# EAGLE design mindbrain_schematic_v2 (EAGLE 7.2.0)
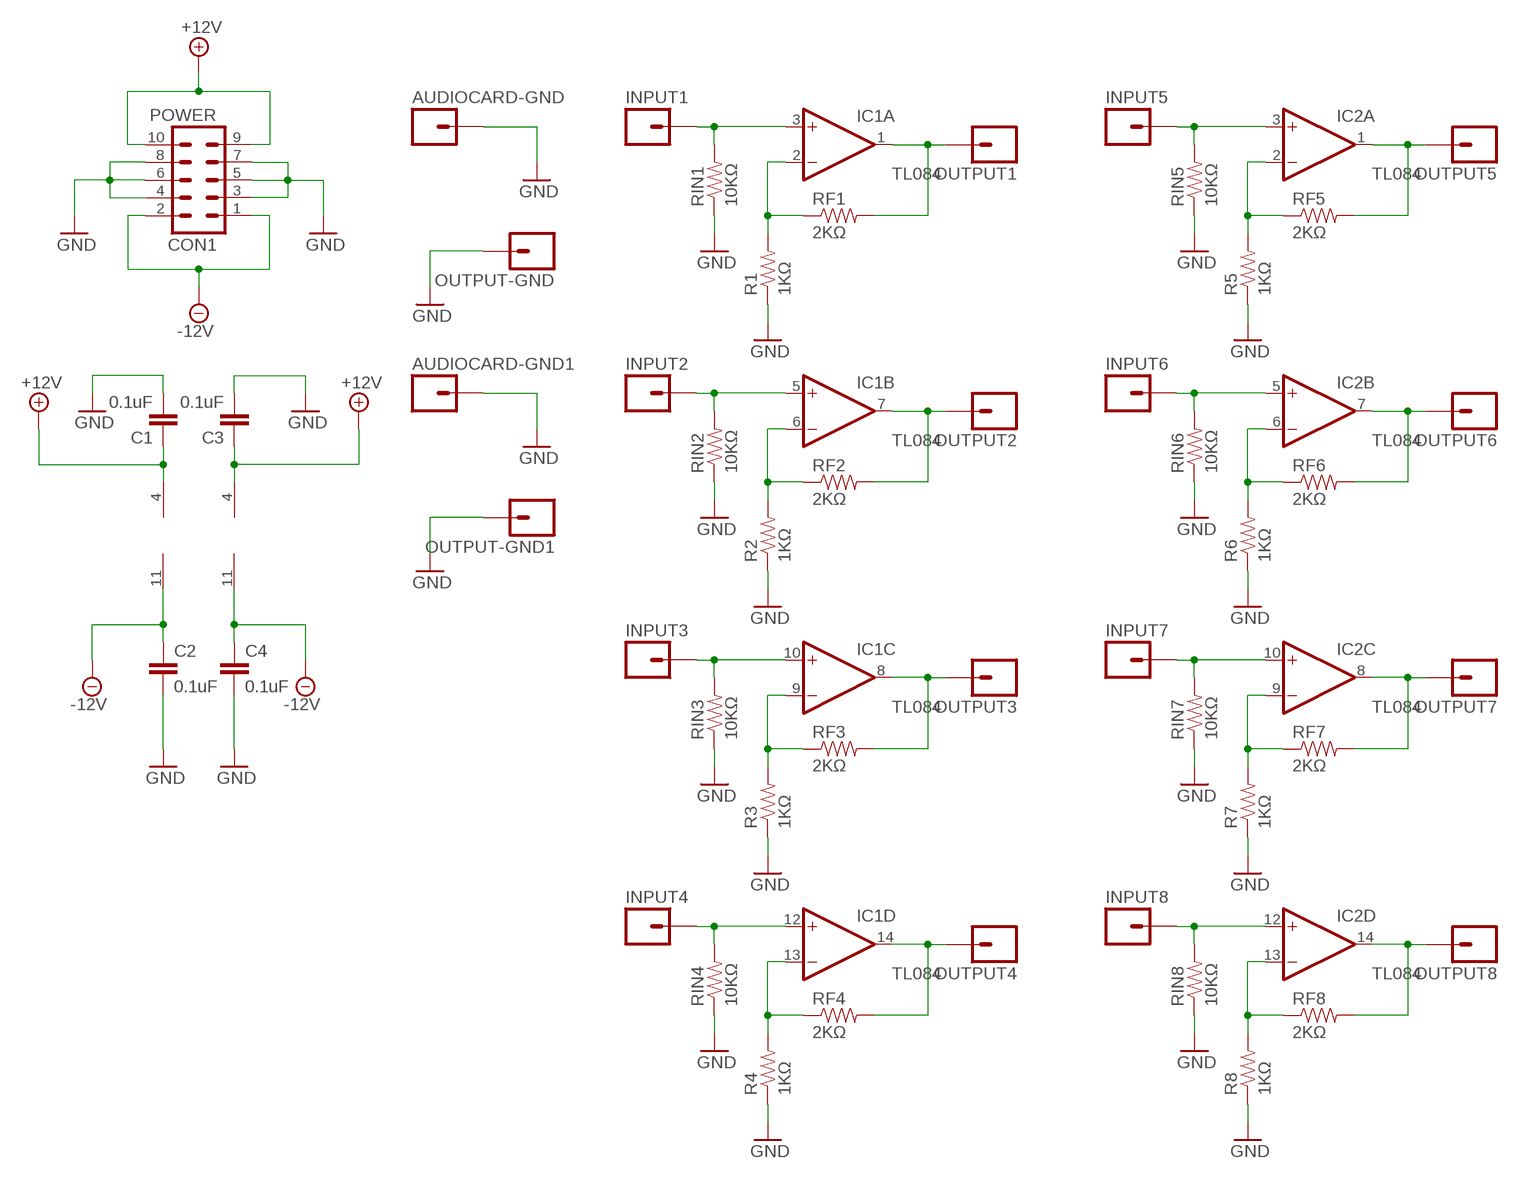
[diagram p0: schematic, sheet 1]

## Parts
AUDIOCARD-GND  M01NOSILK-KIT  [1X01NS-KIT]
AUDIOCARD-GND1  M01NOSILK-KIT  [1X01NS-KIT]
C1  0.1uF  CAPKIT  [CAP-PTH-SMALL-KIT]
C2  0.1uF  CAPKIT  [CAP-PTH-SMALL-KIT]
C3  0.1uF  CAPKIT  [CAP-PTH-SMALL-KIT]
C4  0.1uF  CAPKIT  [CAP-PTH-SMALL-KIT]
CON1  POWER  M05X2SHD  [2X5-SHROUDED]
IC1  TL084  TL084P  [DIL14]
IC2  TL084  TL084P  [DIL14]
INPUT1  M01NOSILK-KIT  [1X01NS-KIT]
INPUT2  M01NOSILK-KIT  [1X01NS-KIT]
INPUT3  M01NOSILK-KIT  [1X01NS-KIT]
INPUT4  M01NOSILK-KIT  [1X01NS-KIT]
INPUT5  M01NOSILK-KIT  [1X01NS-KIT]
INPUT6  M01NOSILK-KIT  [1X01NS-KIT]
INPUT7  M01NOSILK-KIT  [1X01NS-KIT]
INPUT8  M01NOSILK-KIT  [1X01NS-KIT]
OUTPUT1  M01NOSILK-KIT  [1X01NS-KIT]
OUTPUT2  M01NOSILK-KIT  [1X01NS-KIT]
OUTPUT3  M01NOSILK-KIT  [1X01NS-KIT]
OUTPUT4  M01NOSILK-KIT  [1X01NS-KIT]
OUTPUT5  M01NOSILK-KIT  [1X01NS-KIT]
OUTPUT6  M01NOSILK-KIT  [1X01NS-KIT]
OUTPUT7  M01NOSILK-KIT  [1X01NS-KIT]
OUTPUT8  M01NOSILK-KIT  [1X01NS-KIT]
OUTPUT-GND  M01NOSILK-KIT  [1X01NS-KIT]
OUTPUT-GND1  M01NOSILK-KIT  [1X01NS-KIT]
R1  1KΩ  RESISTORPTH-1/4W  [AXIAL-0.4]
R2  1KΩ  RESISTORPTH-1/4W  [AXIAL-0.4]
R3  1KΩ  RESISTORPTH-1/4W  [AXIAL-0.4]
R4  1KΩ  RESISTORPTH-1/4W  [AXIAL-0.4]
R5  1KΩ  RESISTORPTH-1/4W  [AXIAL-0.4]
R6  1KΩ  RESISTORPTH-1/4W  [AXIAL-0.4]
R7  1KΩ  RESISTORPTH-1/4W  [AXIAL-0.4]
R8  1KΩ  RESISTORPTH-1/4W  [AXIAL-0.4]
RF1  2KΩ  RESISTORPTH-1/4W  [AXIAL-0.4]
RF2  2KΩ  RESISTORPTH-1/4W  [AXIAL-0.4]
RF3  2KΩ  RESISTORPTH-1/4W  [AXIAL-0.4]
RF4  2KΩ  RESISTORPTH-1/4W  [AXIAL-0.4]
RF5  2KΩ  RESISTORPTH-1/4W  [AXIAL-0.4]
RF6  2KΩ  RESISTORPTH-1/4W  [AXIAL-0.4]
RF7  2KΩ  RESISTORPTH-1/4W  [AXIAL-0.4]
RF8  2KΩ  RESISTORPTH-1/4W  [AXIAL-0.4]
RIN1  10KΩ  RESISTORPTH-1/4W  [AXIAL-0.4]
RIN2  10KΩ  RESISTORPTH-1/4W  [AXIAL-0.4]
RIN3  10KΩ  RESISTORPTH-1/4W  [AXIAL-0.4]
RIN4  10KΩ  RESISTORPTH-1/4W  [AXIAL-0.4]
RIN5  10KΩ  RESISTORPTH-1/4W  [AXIAL-0.4]
RIN6  10KΩ  RESISTORPTH-1/4W  [AXIAL-0.4]
RIN7  10KΩ  RESISTORPTH-1/4W  [AXIAL-0.4]
RIN8  10KΩ  RESISTORPTH-1/4W  [AXIAL-0.4]

## Nets
+12V: C1.1 C3.1 CON1.9 CON1.10 IC1.4(P:V+) IC2.4(P:V+)
-12V: C2.1 C4.1 CON1.1 CON1.2 IC1.11(P:V-) IC2.11(P:V-)
GND: AUDIOCARD-GND1.1 AUDIOCARD-GND.1 C1.2 C2.2 C3.2 C4.2 CON1.3 CON1.4 CON1.5 CON1.6 CON1.7 CON1.8 OUTPUT-GND1.1 OUTPUT-GND.1 R1.P$1 R2.P$1 R3.P$1 R4.P$1 R5.P$1 R6.P$1 R7.P$1 R8.P$1 RIN1.P$1 RIN2.P$1 RIN3.P$1 RIN4.P$1 RIN5.P$1 RIN6.P$1 RIN7.P$1 RIN8.P$1
N$1: IC1.3(A:+IN) INPUT1.1 RIN1.P$2
N$2: IC1.1(A:OUT) OUTPUT1.1 RF1.P$2
N$3: IC1.2(A:-IN) R1.P$2 RF1.P$1
N$4: IC1.5(B:+IN) INPUT2.1 RIN2.P$2
N$5: IC1.7(B:OUT) OUTPUT2.1 RF2.P$2
N$6: IC1.6(B:-IN) R2.P$2 RF2.P$1
N$7: IC1.10(C:+IN) INPUT3.1 RIN3.P$2
N$8: IC1.8(C:OUT) OUTPUT3.1 RF3.P$2
N$9: IC1.9(C:-IN) R3.P$2 RF3.P$1
N$10: IC1.12(D:+IN) INPUT4.1 RIN4.P$2
N$11: IC1.14(D:OUT) OUTPUT4.1 RF4.P$2
N$12: IC1.13(D:-IN) R4.P$2 RF4.P$1
N$13: IC2.3(A:+IN) INPUT5.1 RIN5.P$2
N$14: IC2.1(A:OUT) OUTPUT5.1 RF5.P$2
N$15: IC2.2(A:-IN) R5.P$2 RF5.P$1
N$16: IC2.5(B:+IN) INPUT6.1 RIN6.P$2
N$17: IC2.7(B:OUT) OUTPUT6.1 RF6.P$2
N$18: IC2.6(B:-IN) R6.P$2 RF6.P$1
N$19: IC2.10(C:+IN) INPUT7.1 RIN7.P$2
N$20: IC2.8(C:OUT) OUTPUT7.1 RF7.P$2
N$21: IC2.9(C:-IN) R7.P$2 RF7.P$1
N$22: IC2.12(D:+IN) INPUT8.1 RIN8.P$2
N$23: IC2.14(D:OUT) OUTPUT8.1 RF8.P$2
N$24: IC2.13(D:-IN) R8.P$2 RF8.P$1

## Library data of the parts
AUDIOCARD-GND AUDIOCARD-GND1 INPUT1-INPUT8 OUTPUT1-OUTPUT8 OUTPUT-GND OUTPUT-GND1 = SparkFun-Connectors:M01: Header 1 Standard 1-pin 0.1" header. Use with straight break away headers (SKU : PRT-00116), right angle break away headers (PRT-00553), swiss pins (PRT-00743), machine pins (PRT-00117), and female headers (PRT-00115).
C1-C4 = SparkFun-Capacitors:CAP: Capacitor Standard 0603 ceramic capacitor, and 0.1" leaded capacitor.
CON1 = SparkFun-Connectors:M05X2: Header 5x2 Standard 10-pin dual row 0.1" header. Commonly used with AVR-ISP. Use with Spark Fun Electronics SKU: PRT-00778
IC1 IC2 = linear:TL084: OP AMP
R1-R8 RF1-RF8 RIN1-RIN8 = SparkFun-Passives:RESISTOR: Resistor Basic schematic elements and footprints for 0603, 1206, and PTH resistors.

## Board
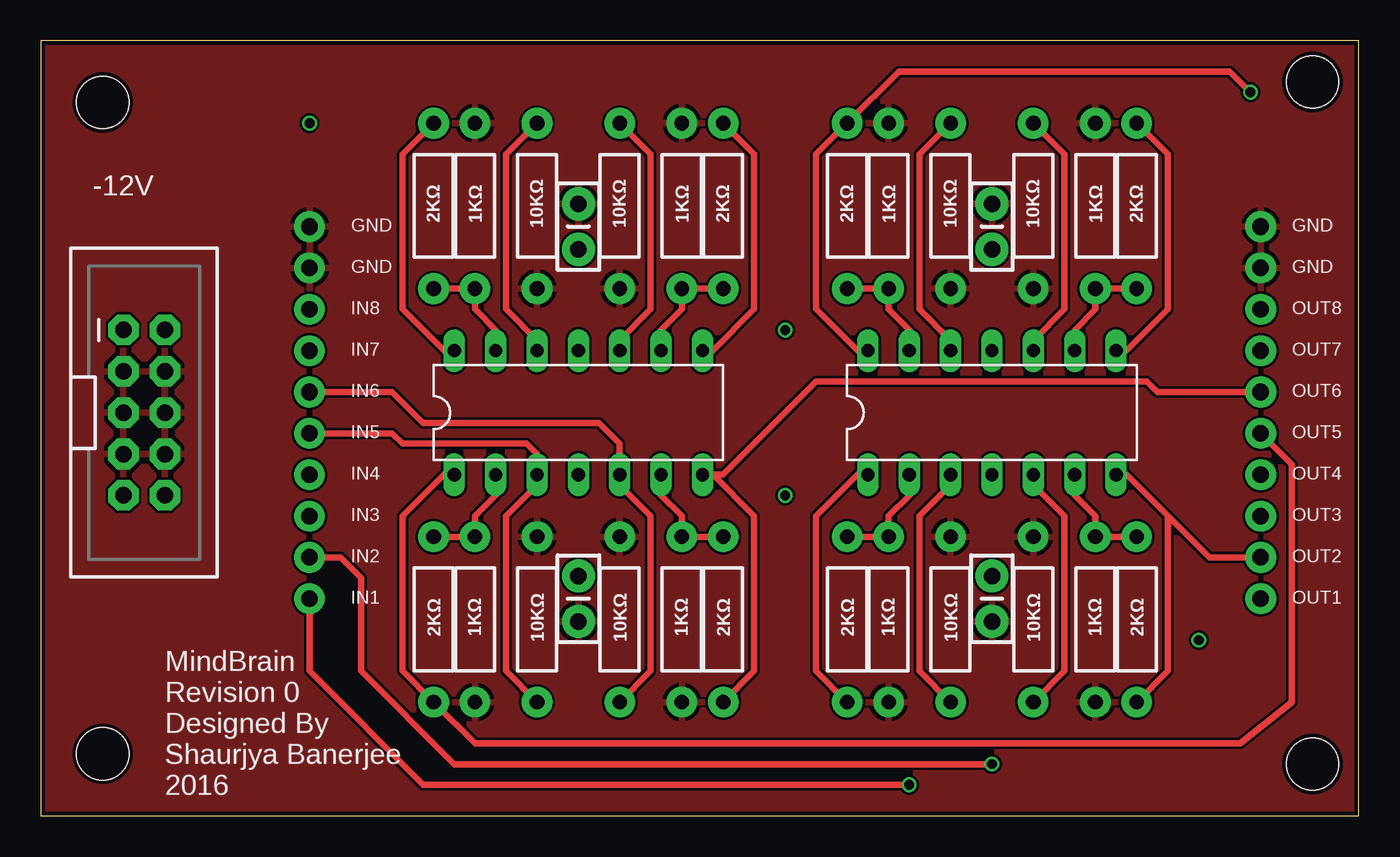
[diagram p1: board, top side]
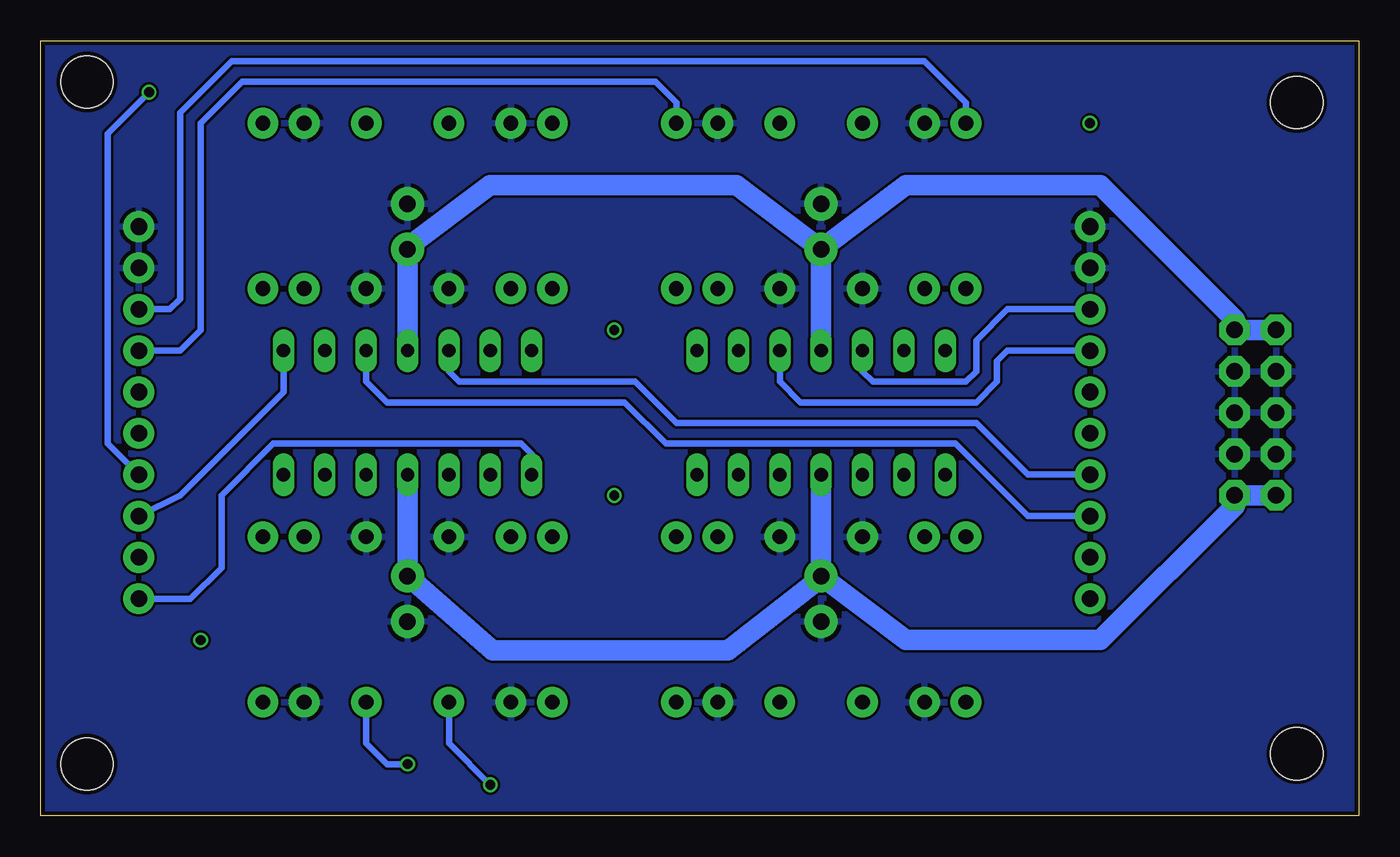
[diagram p2: board, bottom side, seen from below]

Size 80.95 x 47.62 mm. Coordinates in mm from the lower left corner, seen from the top.
Outline: 0,0 80.95,0 80.95,47.62 0,47.62 0,0
Copper layers (1*16): Top 0.035mm / dielectric 1.5mm / Bottom 0.035mm
Design rules "SeeedStudio_2layer_DRU_no_angle_20140221": minimum track width 6mil, minimum drill 12mil, track to track 6mil, track to pad 6mil, pad to pad 6mil, via to via 6mil, smd to smd 0mil, copper to edge 10mil, drill to drill 10mil, minimum pad ring 10mil, minimum via ring 6mil, stop-mask expansion 2mil, vias tented up to drill 100mil, thermal gap 10mil
Holes 3.2 mm at 3.81,43.81 3.81,3.81 78.11,3.17 78.11,45.09

### Footprints (pad centres in the part's own frame; a part is rotated, then mirrored left to right if it is on the bottom)
1X01NS-KIT = drill 1.016 pad 1.88: 1 0,0
CAP-PTH-SMALL-KIT = drill 1.016 pad 2.032: 1 -1.397,0; 2 1.397,0
2X5-SHROUDED = drill 1.016 pad 1.88 octagon: 1 -1.27,5.08; 2 1.27,5.08; 3 -1.27,2.54; 4 1.27,2.54; 5 -1.27,0; 6 1.27,0; 7 -1.27,-2.54; 8 1.27,-2.54; 9 -1.27,-5.08; 10 1.27,-5.08
DIL14 = drill 0.813 long: 1 -7.62,-3.81; 2 -5.08,-3.81; 3 -2.54,-3.81; 4 0,-3.81; 5 2.54,-3.81; 6 5.08,-3.81; 7 7.62,-3.81; 8 7.62,3.81; 9 5.08,3.81; 10 2.54,3.81; 11 0,3.81; 12 -2.54,3.81; 13 -5.08,3.81; 14 -7.62,3.81
AXIAL-0.4 = drill 0.9 pad 1.88: P$1 -5.08,0; P$2 5.08,0

### Placement (x,y rotation side)
AUDIOCARD-GND  16.51,33.66 0 top
AUDIOCARD-GND1  16.51,36.2 0 top
C1  33.02,13.34 270 top
C2  58.42,36.2 90 top
C3  58.42,13.34 270 top
C4  33.02,36.2 90 top
CON1  6.35,24.77 0 top
IC1  58.42,24.77 0 top
IC2  33.02,24.77 0 top
INPUT1  16.51,13.34 0 top
INPUT2  16.51,15.88 0 top
INPUT3  16.51,18.41 0 top
INPUT4  16.51,20.95 0 top
INPUT5  16.51,23.5 90 top
INPUT6  16.51,26.04 0 top
INPUT7  16.51,28.57 0 top
INPUT8  16.51,31.11 90 top
OUTPUT1  74.93,13.34 0 top
OUTPUT2  74.93,15.88 0 top
OUTPUT3  74.93,18.41 0 top
OUTPUT4  74.93,20.95 0 top
OUTPUT5  74.93,23.5 0 top
OUTPUT6  74.93,26.04 0 top
OUTPUT7  74.93,28.57 0 top
OUTPUT8  74.93,31.11 0 top
OUTPUT-GND  74.93,33.66 0 top
OUTPUT-GND1  74.93,36.2 0 top
R1  52.07,12.06 90 top
R2  64.77,12.06 90 top
R3  64.77,37.47 270 top
R4  52.07,37.47 270 top
R5  26.67,12.06 90 top
R6  39.37,12.06 90 top
R7  39.37,37.47 270 top
R8  26.67,37.47 270 top
RF1  49.53,12.06 270 top
RF2  67.31,12.06 270 top
RF3  67.31,37.47 90 top
RF4  49.53,37.47 90 top
RF5  24.13,12.06 270 top
RF6  41.91,12.06 270 top
RF7  41.91,37.47 90 top
RF8  24.13,37.47 90 top
RIN1  55.88,12.06 270 top
RIN2  60.96,12.06 270 top
RIN3  60.96,37.47 90 top
RIN4  55.88,37.47 90 top
RIN5  30.48,12.06 270 top
RIN6  35.56,12.06 270 top
RIN7  35.56,37.47 90 top
RIN8  30.48,37.47 90 top

### Tracks (layer width: path | path; a pad name or v marks a point on that pad's centre or on a via)
+12V
  Bottom 0.406: CON1.10 7.62,19.05
  Bottom 1.27: CON1.10 CON1.9 | 7.62,19.05 15.88,10.79 27.81,10.79 C1.1 | IC1.4 C3.1 53.21,10.16 38.73,10.16 33.02,14.61 C1.1 | IC2.4 C1.1
-12V
  Bottom 0.406: CON1.2 7.62,30.48 | IC1.11 C2.1
  Bottom 1.27: CON1.2 CON1.1 | 7.62,30.48 15.88,38.73 27.81,38.73 C4.1 | IC2.11 C4.1 | IC1.11 58.42,34.92 53.34,38.73 38.23,38.73 C4.1
GND
  pour Bottom: -0.32,47.94 81.28,47.94 81.28,0.32 -0.32,0.32
  pour Top: -0.32,0.32 81.28,0.32 81.28,47.94 -0.32,47.94
N$1  (via drill 0.6)
  Top 0.406: RIN1.P$2 53.98,8.89 53.98,18.41 55.88,20.32 IC1.3 | INPUT1.1 16.51,8.89 23.5,1.91 v53.34,1.91
  Bottom 0.406: v53.34,1.91 55.88,4.45 RIN1.P$2
N$2
  Top 0.406: RF1.P$2 47.62,8.89 47.62,18.41 50.16,20.95 IC1.1
  Bottom 0.406: IC1.1 50.8,22.23 51.44,22.86 66.67,22.86 69.85,19.68 69.85,15.24 71.75,13.34 OUTPUT1.1
N$3
  Top 0.406: IC1.2 53.34,19.68 52.07,18.41 R1.P$2 RF1.P$1
N$4  (via drill 0.6)
  Top 0.406: RIN2.P$2 62.87,8.89 62.87,18.41 60.96,20.32 IC1.5 | INPUT2.1 18.41,15.88 19.68,14.61 19.68,8.89 25.4,3.17 v58.42,3.17
  Bottom 0.406: v58.42,3.17 59.69,3.17 60.96,4.45 RIN2.P$2
N$5
  Top 0.406: RF2.P$2 69.22,8.89 69.22,18.41 | 69.22,18.41 66.67,20.95 IC1.7 | OUTPUT2.1 71.75,15.88 69.22,18.41
N$6
  Top 0.406: IC1.6 63.5,19.68 64.77,18.41 R2.P$2 RF2.P$1
N$7
  Top 0.406: RIN3.P$2 62.87,40.64 62.87,31.11 60.96,29.21 IC1.10
  Bottom 0.406: INPUT3.1 20.32,18.41 24.77,22.86 42.55,22.86 45.09,25.4 59.69,25.4 60.96,26.67 IC1.10
N$8
  Top 0.406: RF3.P$2 69.22,40.64 69.22,31.11 66.67,28.57 IC1.8
  Bottom 0.406: OUTPUT3.1 72.39,19.68 66.04,26.04 IC1.8
N$9
  Top 0.406: RF3.P$1 R3.P$2 64.77,31.11 63.5,29.84 IC1.9
N$10
  Top 0.406: RIN4.P$2 53.98,40.64 53.98,31.11 55.88,29.21 IC1.12
  Bottom 0.406: INPUT4.1 20.32,20.95 23.5,24.13 41.91,24.13 44.45,26.67 55.24,26.67 55.88,27.3 IC1.12
N$11  (via drill 0.6)
  Top 0.406: IC1.14 50.16,28.57 47.62,31.11 47.62,40.64 RF4.P$2 52.7,45.72 73.03,45.72 v74.3,44.45
  Bottom 0.406: OUTPUT4.1 76.83,22.86 76.83,41.91 v74.3,44.45
N$12
  Top 0.406: RF4.P$1 R4.P$2 52.07,31.11 53.34,29.84 IC1.13
N$13
  Top 0.406: RIN5.P$2 28.57,8.89 28.57,18.41 30.48,20.32 IC2.3 30.48,22.23 29.84,22.86 22.23,22.86 21.59,23.5 INPUT5.1
N$14
  Top 0.406: IC2.1 24.77,20.95 22.23,18.41 22.23,8.89 RF5.P$2 26.67,4.45 73.66,4.45 76.83,6.99 76.83,21.59 OUTPUT5.1
N$15
  Top 0.406: RF5.P$1 R5.P$2 26.67,18.41 27.94,19.68 IC2.2
N$16
  Top 0.406: RIN6.P$2 37.47,8.89 37.47,18.41 35.56,20.32 IC2.5 35.56,22.86 34.29,24.13 23.5,24.13 21.59,26.04 INPUT6.1
N$17
  Top 0.406: RF6.P$2 43.81,8.89 43.81,18.41 41.27,20.95 IC2.7 41.91,20.95 47.62,26.67 67.94,26.67 68.58,26.04 OUTPUT6.1
N$18
  Top 0.406: RF6.P$1 R6.P$2 39.37,18.41 38.1,19.68 IC2.6
N$19
  Top 0.406: RIN7.P$2 37.47,40.64 37.47,31.11 35.56,29.21 IC2.10
  Bottom 0.406: INPUT7.1 21.59,28.57 22.23,27.94 22.23,26.67 23.5,25.4 34.29,25.4 35.56,26.67 IC2.10
N$20
  Top 0.406: RF7.P$2 43.81,40.64 43.81,31.11 41.27,28.57 IC2.8
  Bottom 0.406: OUTPUT7.1 72.39,28.57 71.12,29.84 71.12,42.55 68.58,45.09 43.18,45.09 41.91,43.81 RF7.P$2
N$21
  Top 0.406: RF7.P$1 R7.P$2 39.37,31.11 38.1,29.84 IC2.9
N$22
  Top 0.406: RIN8.P$2 28.57,40.64 28.57,31.11 30.48,29.21 IC2.12
  Bottom 0.406: INPUT8.1 21.59,31.11 23.5,29.21 23.5,27.3 24.13,26.67 29.84,26.67 30.48,27.3 IC2.12
N$23
  Top 0.406: RF8.P$2 22.23,40.64 22.23,31.11 24.77,28.57 IC2.14
  Bottom 0.406: OUTPUT8.1 73.03,31.11 72.39,31.75 72.39,43.18 69.22,46.35 26.67,46.35 24.13,43.81 RF8.P$2
N$24
  Top 0.406: RF8.P$1 R8.P$2 26.67,31.11 27.94,29.84 IC2.13
N$26  (via drill 0.6)
  other vias: 16.51,42.55
N$28  (via drill 0.6)
  other vias: 71.12,10.79
N$29  (via drill 0.6)
  other vias: 45.72,29.84
N$30  (via drill 0.6)
  other vias: 45.72,19.68

### Text on the board
tPlace: -12V | GND | GND | GND | GND | IN8 | OUT8 | IN7 | OUT7 | IN6 | OUT6 | IN5 | OUT5 | IN4 | OUT4 | IN3 | OUT3 | IN2 | OUT2 | IN1 | OUT1 | MindBrain / Revision 0 / Designed By / Shaurjya Banerjee / 2016